# EAGLE design module S-RX28_rev3.3 644 (EAGLE 9.3.1)
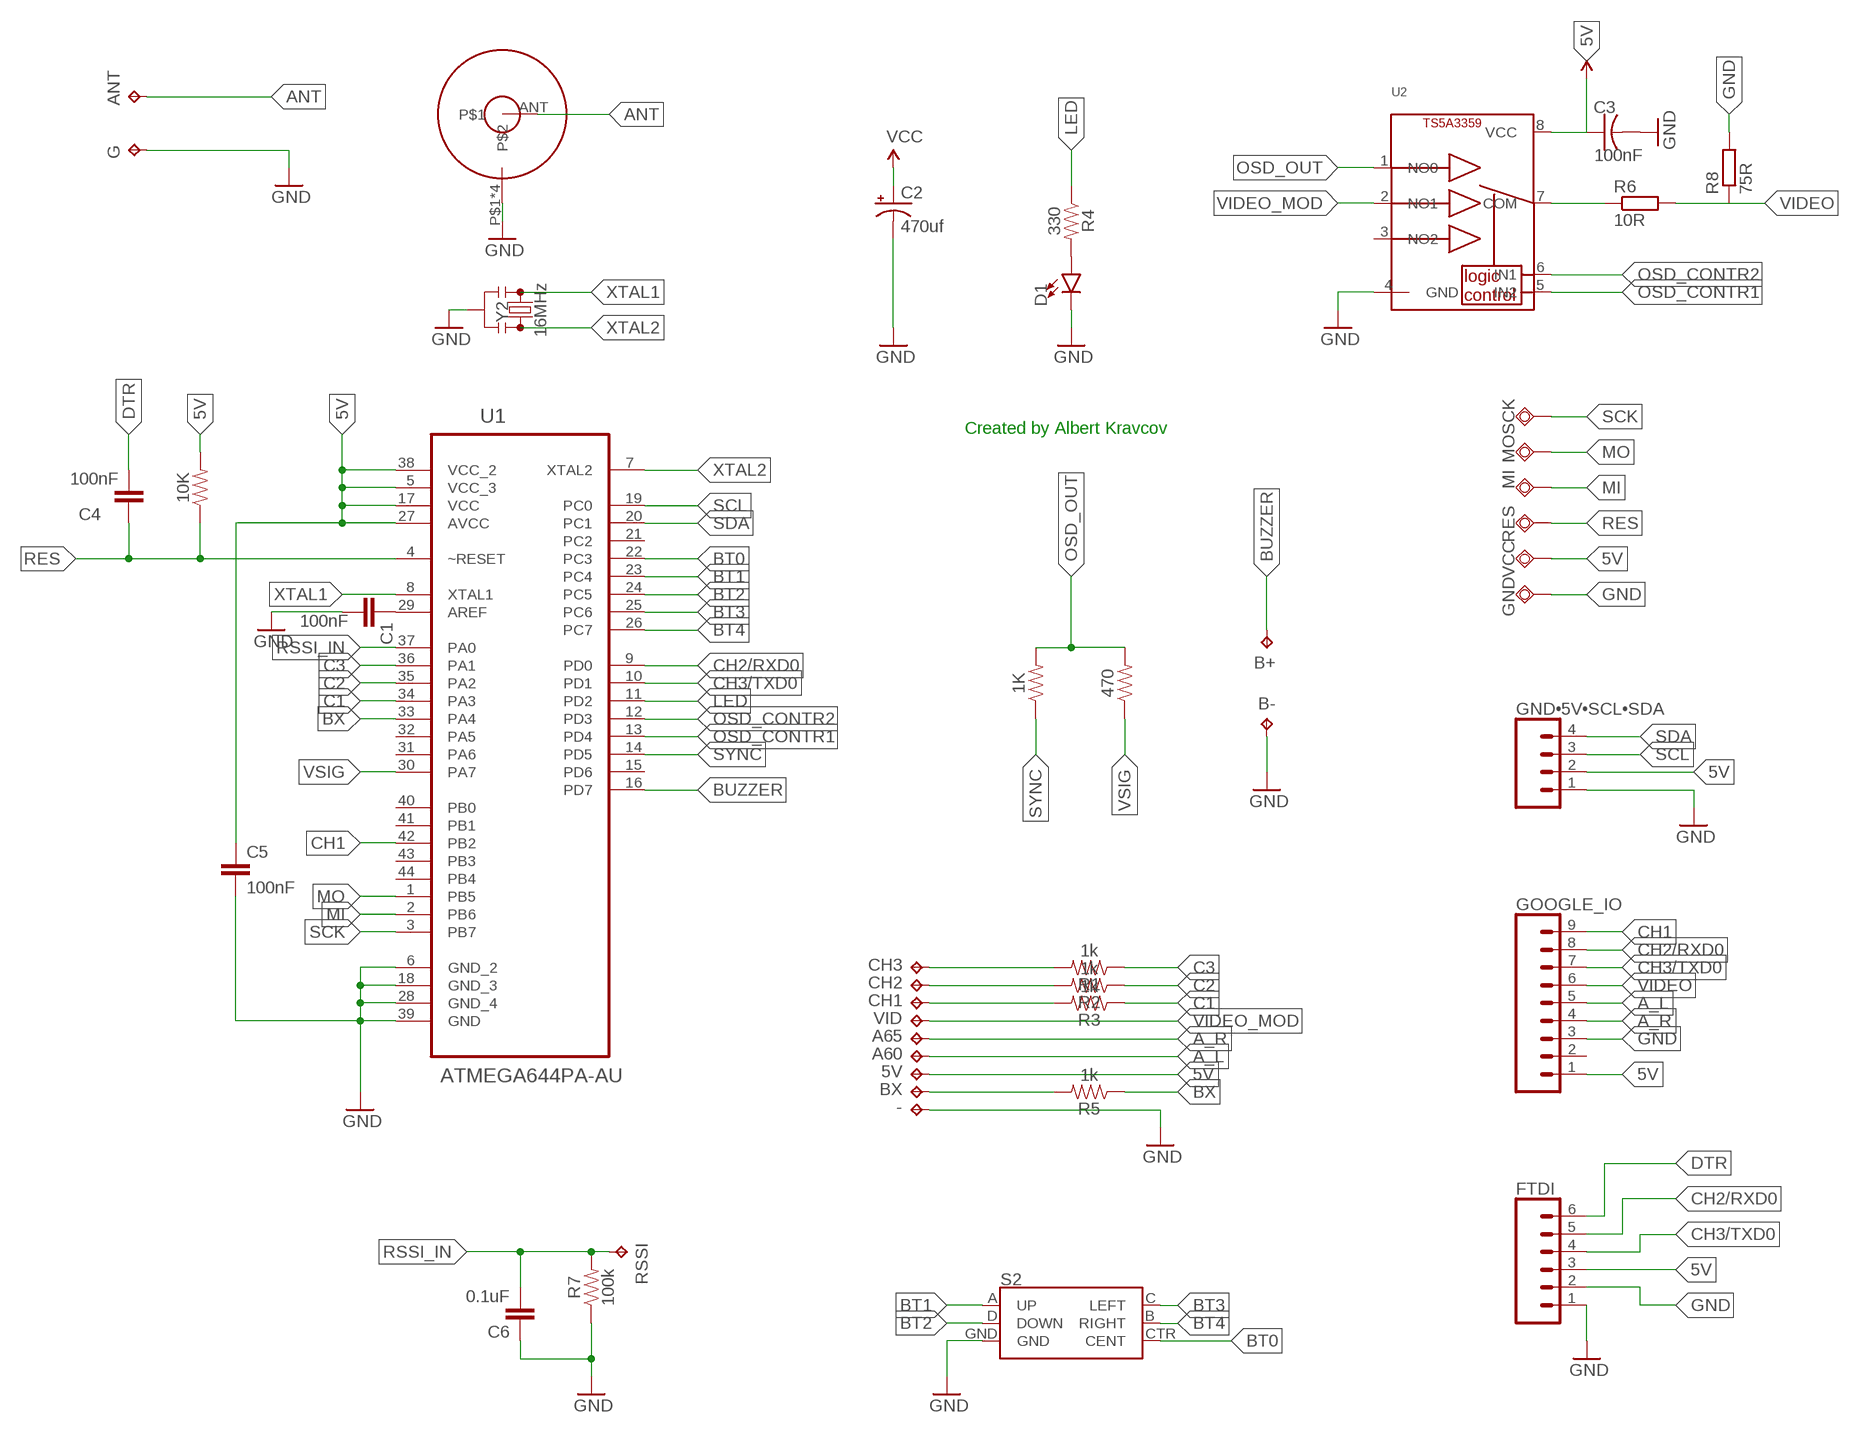
[diagram p0: schematic, sheet 1]

## Parts
1K  0.27OHM-0603-1/10W-1%  [0603]
5V  TPTP15SQ  [TP15SQ]
10K  0.27OHM-0603-1/10W-1%  [0603]
470  0.27OHM-0603-1/10W-1%  [0603]
-  TPTP15SQ  [TP15SQ]
A60  TPTP15SQ  [TP15SQ]
A65  TPTP15SQ  [TP15SQ]
ANT  TPTP15R  [TP15R]
B+  TPTP17SQ  [TP17SQ]
B-  TPTP17SQ  [TP17SQ]
BX  TPTP15SQ  [TP15SQ]
C1  100nF  10NF-0603-50V-10%  [0603]
C2  470uf  CAP_POL7343  [EIA7343]
C3  100nF  C-USC0603  [C0603]
C4  100nF  10NF-0603-50V-10%  [0603]
C5  100nF  10NF-0603-50V-10%  [0603]
C6  0.1uF  10NF-0603-50V-10%  [0603]
CH1  TPTP15SQ  [TP15SQ]
CH2  TPTP15SQ  [TP15SQ]
CH3  TPTP15SQ  [TP15SQ]
D1  LED0603  [LED-0603]
FTDI  CONN_06SMD-1MM  [1X06-1MM]
G  TPTP15SQ  [TP15SQ]
GND  GND  TPSQB1,27  [B1,27]
GND•5V•SCL•SDA  CONN_04  [1X04]
GOOGLE_IO  CONN_09  [1X09]
MI  TPSQB1,27  [B1,27]
MO  TPSQB1,27  [B1,27]
R1  1k  0.05OHM-0603-1/5W-1%  [0603]
R2  1k  0.05OHM-0603-1/5W-1%  [0603]
R3  1k  0.05OHM-0603-1/5W-1%  [0603]
R4  330  0.05OHM-0603-1/5W-1%  [0603]
R5  1k  0.05OHM-0603-1/5W-1%  [0603]
R6  10R  R-EU_R0603  [R0603]
R7  100k  0.05OHM-0603-1/5W-1%  [0603]
R8  75R  R-EU_R0603  [R0603]
RES  TPSQB1,27  [B1,27]
RSSI  TPTP15SQ  [TP15SQ]
S2  JOYSTICK_MINI  [JOYSTICK_MINI]
SCK  TPSQB1,27  [B1,27]
U1  ATMEGA644PA-AU  [QFP80P1200X1200X120-44N]
U2  TS5A3359  [VFSOP-8]
U$1  SMA_ANTENNA  [SMA_CONNECTOR]
VCC  TPSQB1,27  [B1,27]
VID  TPTP15SQ  [TP15SQ]
Y2  16MHz  RESONATOR-16MHZSMD_3.2X1.3  [RESONATOR-SMD-3.2X1.3]

## Nets
5V: 5V.TP 10K.2 C2.A(+) C3.1 C5.1 FTDI.3 GND•5V•SCL•SDA.2 GOOGLE_IO.1 U1.5(VCC_3) U1.17(VCC) U1.27(AVCC) U1.38(VCC_2) U2.8(VCC) VCC.TP ; supply symbol labelled VCC
A_L: A60.TP GOOGLE_IO.5
A_R: A65.TP GOOGLE_IO.4
ANT [power]: ANT.TP U$1.ANT
AREF: C1.1 U1.29(AREF)
BT0: S2.CTR(CENT) U1.22(PC3)
BT1: S2.A(UP) U1.23(PC4)
BT2: S2.D(DOWN) U1.24(PC5)
BT3: S2.C(LEFT) U1.25(PC6)
BT4: S2.B(RIGHT) U1.26(PC7)
BUZZER: B+.TP U1.16(PD7)
BX: R5.1 U1.33(PA4)
C1: R3.1 U1.34(PA3)
C2: R2.1 U1.35(PA2)
C3: R1.1 U1.36(PA1)
CH1: GOOGLE_IO.9 U1.42(PB2)
CH2/RXD0: FTDI.5 GOOGLE_IO.8 U1.9(PD0)
CH3/TXD0: FTDI.4 GOOGLE_IO.7 U1.10(PD1)
DTR: C4.2 FTDI.6
GND: -.TP B-.TP C1.2 C2.C(-) C3.2 C5.2 C6.1 D1.C FTDI.1 FTDI.2 G.TP GND.TP GND•5V•SCL•SDA.1 GOOGLE_IO.3 R7.1 R8.2 S2.GND U1.6(GND_2) U1.18(GND_3) U1.28(GND_4) U1.39(GND) U2.4(GND) U$1.P$1 U$1.P$2 U$1.P$3 U$1.P$4 Y2.2
LED: R4.1 U1.11(PD2)
MI: MI.TP U1.2(PB6)
MO: MO.TP U1.1(PB5)
N$1: CH3.TP R1.2
N$3: CH2.TP R2.2
N$4: CH1.TP R3.2
N$5: BX.TP R5.2
OSD_CONTR1: U1.13(PD4) U2.5(IN2)
OSD_CONTR2: U1.12(PD3) U2.6(IN1)
OSD_OUT: 1K.2 470.2 U2.1(NO0)
RED: D1.A R4.2
RES: 10K.1 C4.1 RES.TP U1.4(~RESET)
RSSI_IN: C6.2 R7.2 RSSI.TP U1.37(PA0)
SCK: SCK.TP U1.3(PB7)
SCL: GND•5V•SCL•SDA.3 U1.19(PC0)
SDA: GND•5V•SCL•SDA.4 U1.20(PC1)
SYNC: 1K.1 U1.14(PD5)
VIDEO [power]: GOOGLE_IO.6 R6.2 R8.1
VIDEO_MOD: U2.2(NO1) VID.TP
VIDEOOUTPUT: R6.1 U2.7(COM)
VSIG [power]: 470.1 U1.30(PA7)
XTAL1: U1.8(XTAL1) Y2.1
XTAL2: U1.7(XTAL2) Y2.3
Unconnected: GOOGLE_IO.2 U1.15(PD6) U1.21(PC2) U1.31(PA6) U1.32(PA5) U1.40(PB0) U1.41(PB1) U1.43(PB3) U1.44(PB4) U2.3(NO2)

## Notes on the sheet
- Created by Albert Kravcov

## Library data of the parts
1K 10K 470 = SparkFun-Resistors:0.27OHM: 0.27Ω resistor A resistor is a passive two-terminal electrical component that implements electrical resistance as a circuit element. Resistors act to reduce current flow, and, at the same time, act to lower voltage levels within circuits. - Wikipedia; PROD_ID: RES-08787; VALUE: 0.27
5V - A60 A65 ANT B+ B- BX CH1-CH3 G RSSI VID = testpad:TP: Test pad
C1 C4-C6 = SparkFun-Capacitors:10NF: 0.01uF/10nF/10,000pF ceramic capacitors A capacitor is a passive two-terminal electrical component used to store electrical energy temporarily in an electric field. CAP-09321; PROD_ID: CAP-00867; VALUE: 10nF
C2 = SparkFun-Passives:CAP_POL: Capacitor Polarized These are standard SMD and PTH capacitors. Normally 10uF, 47uF, and 100uF in electrolytic and tantalum varieties. Always verify the external diameter of the through hole cap, it varies with capacity, voltage, and manufacturer. The EIA devices should be standard.
C3 = adafruit:C-US: CAPACITOR, American symbol
D1 = SparkFun-LED:LED: LED (Generic) Standard schematic elements and footprints for 5mm, 3mm, 1206, and 0603 sized LEDs. Generic LEDs with no color specified.
FTDI = SparkFun-Connectors:CONN_06: Multi connection point. Often used as Generic Header-pin footprint for 0.1 inch spaced/style header connections On any of the 0.1 inch spaced packages, you can populate with these: Break Away Headers - Straight <https://www.sparkfun.com/products/116> (PRT-00116) Break Away Male Headers - Right Angle <https://www.sparkfun.com/products/553> (PRT-00553) Female Headers <https://www.sparkfun.com/products/115> (PRT-00115) Break Away Headers - Machine Pin <https://www.sparkfun.com/products/117> (PRT-00117) Break Away Female Headers - Swiss Machine Pin <https://www.sparkfun.com/products/743> (PRT-00743) Arduino Stackable Header - 6 Pin <https://www.sparkfun.com/products/9280> (PRT-09280) For SCREWTERMINALS and SPRING TERMINALS visit here: Screw Terimnals on SparkFun.com <https://www.sparkfun.com/search/results?term=Screw+Terminals> (5mm/3.5mm/2.54mm spacing) This device is also useful as a general connection point to wire up your design to another part of your project. Our various solder wires solder well into these plated through hole pads. Hook-Up Wire - Assortment (Stranded, 22 AWG) <https://www.sparkfun.com/products/11375> (PRT-11375) Hook-Up Wire - Assortment (Solid Core, 22 AWG) <https://www.sparkfun.com/products/11367> (PRT-11367) View the entire wire category on our website here <https://www.sparkfun.com/categories/141>; PROD_ID: CONN-08249; SF_ID: GPS-00579
GND MI MO RES SCK VCC = testpad:TPSQ: Test pad
GND•5V•SCL•SDA = SparkFun-Connectors:CONN_04: Multi connection point. Often used as Generic Header-pin footprint for 0.1 inch spaced/style header connections On any of the 0.1 inch spaced packages, you can populate with these: Break Away Headers - Straight <https://www.sparkfun.com/products/116> (PRT-00116) Break Away Male Headers - Right Angle <https://www.sparkfun.com/products/553> (PRT-00553) Female Headers <https://www.sparkfun.com/products/115> (PRT-00115) Break Away Headers - Machine Pin <https://www.sparkfun.com/products/117> (PRT-00117) Break Away Female Headers - Swiss Machine Pin <https://www.sparkfun.com/products/743> (PRT-00743) For SCREWTERMINALS and SPRING TERMINALS visit here: Screw Terimnals on SparkFun.com <https://www.sparkfun.com/search/results?term=Screw+Terminals> (5mm/3.5mm/2.54mm spacing) This device is also useful as a general connection point to wire up your design to another part of your project. Our various solder wires solder well into these plated through hole pads. Hook-Up Wire - Assortment (Stranded, 22 AWG) <https://www.sparkfun.com/products/11375> (PRT-11375) Hook-Up Wire - Assortment (Solid Core, 22 AWG) <https://www.sparkfun.com/products/11367> (PRT-11367) View the entire wire category on our website here <https://www.sparkfun.com/categories/141> Special notes: Molex polarized connector foot print use with SKU : PRT-08231 with associated crimp pins and housings. 1MM SMD Version SKU: PRT-10208; PROD_ID: CONN-09696
GOOGLE_IO = SparkFun-Connectors:CONN_09: Multi connection point. Often used as Generic Header-pin footprint for 0.1 inch spaced/style header connections On any of the 0.1 inch spaced packages, you can populate with these: Break Away Headers - Straight <https://www.sparkfun.com/products/116> (PRT-00116) Break Away Male Headers - Right Angle <https://www.sparkfun.com/products/553> (PRT-00553) Female Headers <https://www.sparkfun.com/products/115> (PRT-00115) Break Away Headers - Machine Pin <https://www.sparkfun.com/products/117> (PRT-00117) Break Away Female Headers - Swiss Machine Pin <https://www.sparkfun.com/products/743> (PRT-00743) For SCREWTERMINALS and SPRING TERMINALS visit here: Screw Terimnals on SparkFun.com <https://www.sparkfun.com/search/results?term=Screw+Terminals> (5mm/3.5mm/2.54mm spacing) This device is also useful as a general connection point to wire up your design to another part of your project. Our various solder wires solder well into these plated through hole pads. Hook-Up Wire - Assortment (Stranded, 22 AWG) <https://www.sparkfun.com/products/11375> (PRT-11375) Hook-Up Wire - Assortment (Solid Core, 22 AWG) <https://www.sparkfun.com/products/11367> (PRT-11367) View the entire wire category on our website here <https://www.sparkfun.com/categories/141> Special notes: Molex polarized connector foot print use with SKU : PRT-08231 with associated crimp pins and housings. 1MM SMD Version SKU: PRT-10208 NOTES ON THE VARIANTS LOCK and LOCK_LONGPADS... This footprint was designed to help hold the alignment of a through-hole component (i.e. 6-pin header) while soldering it into place. You may notice that each hole has been shifted either up or down by 0.005 of an inch from it's more standard position (which is a perfectly straight line). This slight alteration caused the pins (the squares in the middle) to touch the edges of the holes. Because they are alternating, it causes a "brace" to hold the component in place. 0.005 has proven to be the perfect amount of "off-center" position when using our standard breakaway headers. Although looks a little odd when you look at the bare footprint, once you have a header in there, the alteration is very hard to notice. Also,if you push a header all the way into place, it is covered up entirely on the bottom side.
R1-R5 R7 = SparkFun-Resistors:0.05OHM: 0.05Ω resistor A resistor is a passive two-terminal electrical component that implements electrical resistance as a circuit element. Resistors act to reduce current flow, and, at the same time, act to lower voltage levels within circuits. - Wikipedia; PROD_ID: RES-12535; VALUE: 0.05
R6 R8 = resistor:R-EU_: RESISTOR, European symbol
S2 = SparkFun-Switches:JOYSTICK_MINI: Small Tactile Joystick w/ Select Switch A 5-way tactile switch allows for a joystick-like interface in a very small package. Part #: 4UCON SF303GJ26 SparkFun Products 5-way Tactile Switch <https://www.sparkfun.com/products/10063> (COM-10063) Used on SparkFun Block for Intel® Edison - OLED <https://www.sparkfun.com/products/13035> (DEV-13035) Used on CAN-BUS Shield <https://www.sparkfun.com/products/13262> (DEV-13262); PROD_ID: SWCH-09905; SF_SKU: COM-10063
U1 = ATMEGA644PA-AU:ATMEGA644PA-AU: 8-bit Microcontroller Microcontroller In-System Programmable Flash; AVAILABILITY: Unavailable; DESCRIPTION: ATmega Series 20 MHz 64 KB Flash 4 KB SRAM 8-Bit Microcontroller - TQFP-44; MF: Microchip; MP: ATMEGA644PA-AU; PACKAGE: TQFP-44 Microchip; PRICE: None
U2 = ts5a3359:TS5A3359: 74AUP2G126 - Low-Power Dual Tri-State Buffer OE high enables output. For OE Low enabled output use 74AUP2G125. VCC: 0.8-3.6V Temp: -40°C - 125°C Package Variant: 8-VSSOP (SOT765-1) Manuf. ID: 74AUP2G126DC,125 Digikey: 568-4987-1-ND NOTE: Make sure to check the propogation delay to see if it's short enough for your timing since it's largely dependant on the line capacitance and supply voltage!
U$1 = #fpv:SMA_ANTENNA
Y2 = SparkFun-Clocks:RESONATOR-16MHZ: 16MHz Resonator Digikey Example <http://www.digikey.com/product-detail/en/murata-electronics-north-america/CSTCE16M0V53-R0/490-1198-1-ND/584635> Frequency: 16MHz Frequency Stability: ±0.3% Frequency Tolerance: ±0.5% Capacitance: 15pF SparkFun Products SparkFun OpenLog <https://www.sparkfun.com/products/13712> SparkFun MicroView - OLED Arduino Module <https://www.sparkfun.com/products/12923>; PROD_ID: XTAL-08900

## Net classes
0 default: width 0.2 mm, clearance 0.2 mm
1 power: width 0.3 mm, drill 0.3 mm, clearance 0.3 mm

## Board
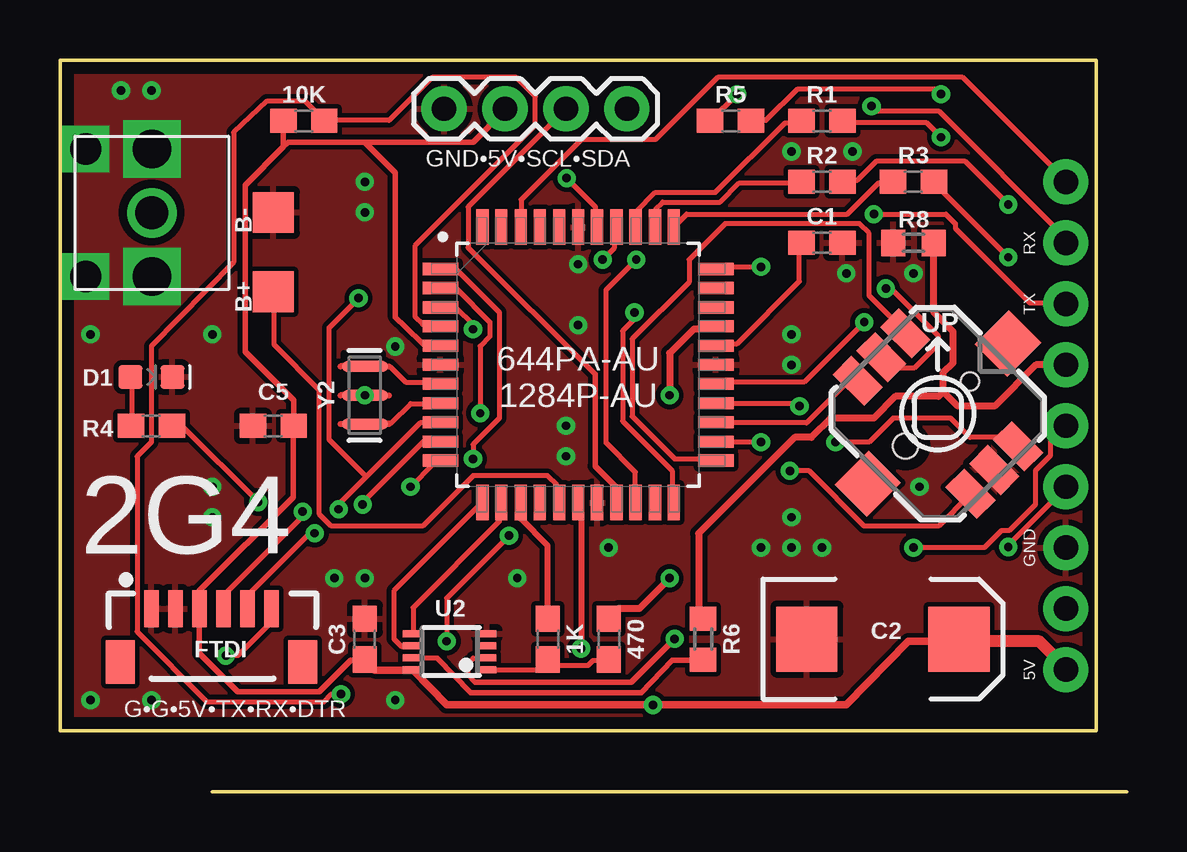
[diagram p1: board, top side]
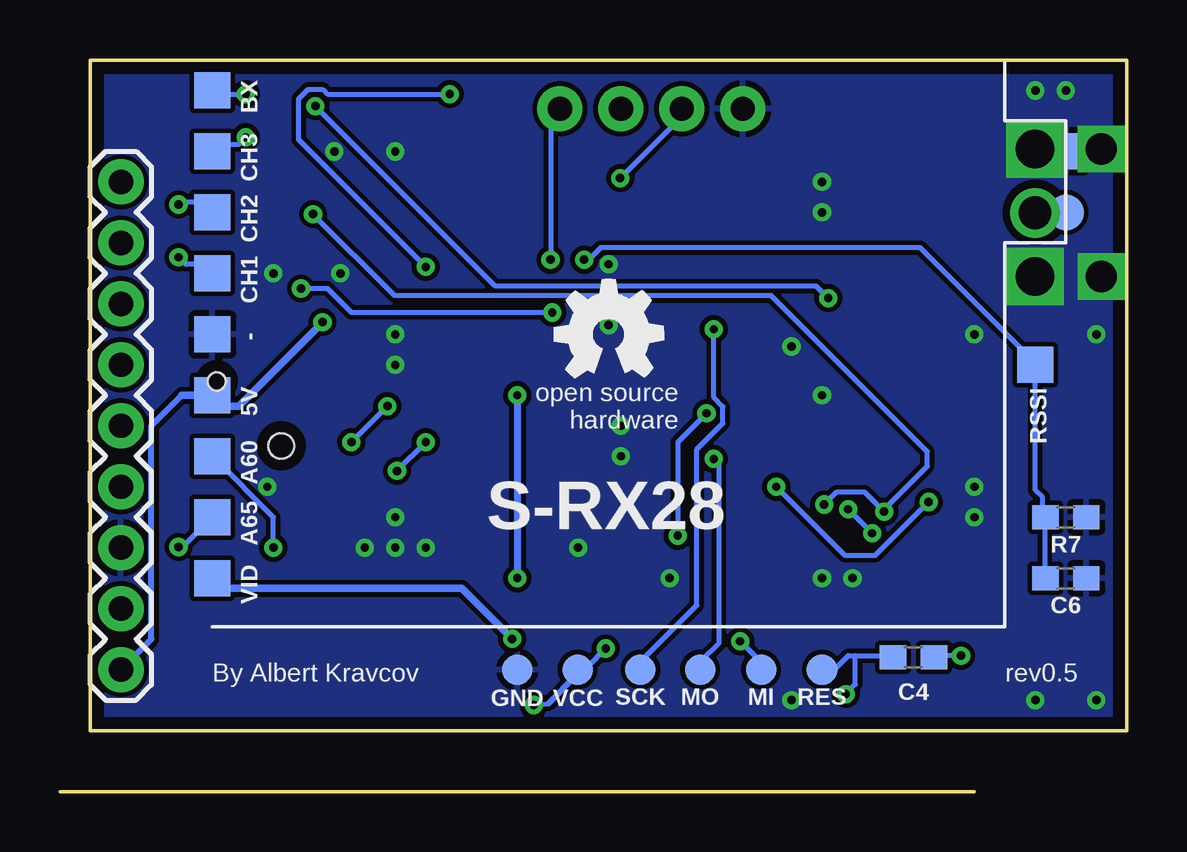
[diagram p2: board, bottom side, seen from below]

Size 44.45 x 30.48 mm. Coordinates in mm from the lower left corner, seen from the top.
Outline: 0,2.54 0,30.48 43.18,30.48 43.18,2.54 0,2.54
Copper layers (1*16): Top 0.035mm / dielectric 1.5mm / Bottom 0.035mm
Design rules "default *": minimum track width 6mil, minimum drill 0.35mm, track to track 6mil, track to pad 6mil, pad to pad 6mil, via to via 6mil, smd to smd 6mil, copper to edge 0.5mm, drill to drill 6mil, minimum pad ring 10mil, minimum via ring 8mil, stop-mask expansion 4mil, vias tented up to drill 2mm, thermal gap 10mil
tRestrict: area 11.8,14.7 to 13.5,18.3

### Footprints (pad centres in the part's own frame; a part is rotated, then mirrored left to right if it is on the bottom)
0603 = smd 1.1 x 1: 1 -0.85,0; 2 0.85,0
TP15SQ = smd 1.5 x 1.5: TP 0,0
TP15R = smd 1.5 x 1.5: TP 0,0
TP17SQ = smd 1.7 x 1.7: TP 0,0
EIA7343 = smd 2.55 x 2.7: A 3.17,0; C -3.17,0
C0603 = smd 1.1 x 1: 1 -0.85,0; 2 0.85,0
LED-0603 = smd 1 x 1: A -0.877,0; C 0.877,0
1X06-1MM = smd 0.6 x 1.55: 1 -2.54,1.27; 2 -1.54,1.27; 3 -0.54,1.27; 4 0.46,1.27; 5 1.46,1.27; 6 2.46,1.27 | smd 1.2 x 1.8: P$1 -3.84,-0.955; P$2 3.76,-0.955
B1,27 = smd 1.27 x 1.27: TP 0,0
1X04 = drill 1.016 pad 1.88: 1 0,0; 2 2.54,0; 3 5.08,0; 4 7.62,0
1X09 = drill 1.016 pad 1.88: 1 0,0; 2 2.54,0; 3 5.08,0; 4 7.62,0; 5 10.16,0; 6 12.7,0; 7 15.24,0; 8 17.78,0; 9 20.32,0
R0603 = smd 1 x 1.1: 1 -0.85,0; 2 0.85,0
JOYSTICK_MINI = smd 1.85 x 1.1: A -3.325,1.4; B 3.325,1.4; C -3.325,-1.4; CTR -3.325,0; D 3.325,-1.4; GND 3.325,0 | smd 1.9 x 2: NC 0,4.13; NC@0 0,-4.13 | hole 0.75: 0,1.9 | hole 1.05: 0,-1.9
QFP80P1200X1200X120-44N = smd 1.473 x 0.508: 1 -5.74,3.988; 2 -5.74,3.2; 3 -5.74,2.388; 4 -5.74,1.6; 5 -5.74,0.787; 6 -5.74,0; 7 -5.74,-0.787; 8 -5.74,-1.6; 9 -5.74,-2.388; 10 -5.74,-3.2; 11 -5.74,-3.988; 23 5.74,-3.988; 24 5.74,-3.2; 25 5.74,-2.388; 26 5.74,-1.6; 27 5.74,-0.787; 28 5.74,0; 29 5.74,0.787; 30 5.74,1.6; 31 5.74,2.388; 32 5.74,3.2; 33 5.74,3.988 | smd 0.508 x 1.473: 12 -3.988,-5.74; 13 -3.2,-5.74; 14 -2.388,-5.74; 15 -1.6,-5.74; 16 -0.787,-5.74; 17 0,-5.74; 18 0.787,-5.74; 19 1.6,-5.74; 20 2.388,-5.74; 21 3.2,-5.74; 22 3.988,-5.74; 34 3.988,5.74; 35 3.2,5.74; 36 2.388,5.74; 37 1.6,5.74; 38 0.787,5.74; 39 0,5.74; 40 -0.787,5.74; 41 -1.6,5.74; 42 -2.388,5.74; 43 -3.2,5.74; 44 -3.988,5.74
VFSOP-8 = smd 0.3 x 0.8: 1 0,0; 2 0.5,0; 3 1,0; 4 1.5,0; 5 1.5,3.1; 6 1,3.1; 7 0.5,3.1; 8 0,3.1
SMA_CONNECTOR = drill 1.37: ANT -0.02,-0.017 | drill 1.3 square: P$1 -2.67,2.743; P$2 2.64,2.743 | drill 1.6 square: P$3 -2.67,-0.017; P$4 2.64,-0.017
RESONATOR-SMD-3.2X1.3 = smd 0.45 x 1.905: 1 -1.2,0; 2 0,0; 3 1.2,0

### Placement (x,y rotation side)
1K  20.32,6.35 270 top
5V  38.1,16.51 0 bottom
10K  10.16,27.94 180 top
470  22.86,6.35 270 top
-  38.1,19.05 0 bottom
A60  38.1,13.97 0 bottom
A65  38.1,11.43 0 bottom
ANT  2.54,24.13 0 bottom
B+  8.89,20.83 0 top
B-  8.89,24.13 0 top
BX  38.1,29.21 0 bottom
C1  31.75,22.86 0 top
C2  34.29,6.35 0 top
C3  12.7,6.35 90 top
C4  8.89,5.59 0 bottom
C5  8.89,15.24 180 top
C6  2.54,8.89 180 bottom
CH1  38.1,21.59 0 bottom
CH2  38.1,24.13 0 bottom
CH3  38.1,26.67 0 bottom
D1  3.81,17.27 0 top
FTDI  6.35,6.35 0 top
G  2.54,26.67 0 bottom
GND  25.4,5.08 0 bottom
GND•5V•SCL•SDA  16,28.45 0 top
GOOGLE_IO  41.91,5.08 90 bottom
MI  15.24,5.08 0 bottom
MO  17.78,5.08 0 bottom
R1  31.75,27.94 0 top
R2  31.75,25.4 0 top
R3  35.56,25.4 0 top
R4  3.81,15.24 180 top
R5  27.94,27.94 0 top
R6  26.8,6.35 90 top
R7  2.54,11.43 180 bottom
R8  35.56,22.86 180 top
RES  12.7,5.08 0 bottom
RSSI  3.81,17.78 0 bottom
S2  36.58,15.75 315 top
SCK  20.27,5.08 0 bottom
U1  21.59,17.78 0 top
U2  17.78,5.08 90 top
U$1  3.81,24.13 90 top
U$2  [OSHW_5MM]  21.59,19.05 0 bottom
VCC  22.89,5.08 0 bottom
VID  38.1,8.89 0 bottom
Y2  12.7,16.51 90 top

### Tracks (layer width: path | path; a pad name or v marks a point on that pad's centre or on a via)
5V  (via drill 0.35)
  Top 0.2: v33.51,19.56 31.01,17.06 27.41,17.06 U1.27 | 37.48,6.26 C2.A 37.38,6.26 | 41.91,5.16 GOOGLE_IO.1 | 18.51,28.36 GND•5V•SCL•SDA.2 | 15.11,18.66 15.81,18.66 U1.5 | v21.11,25.56 22.31,24.36 22.31,23.56 U1.38 | 21.71,11.86 21.61,11.96 U1.17 | 13.11,5.06 12.71,5.46 C3.1 12.61,5.46 | 14.61,5.06 U2.8 14.71,5.06 | FTDI.3 5.81,8.36 | 9.71,14.96 C5.1
  Top 0.229: 9.31,26.86 9.51,27.06 12.7,27.06 | 10K.2 9.31,26.86 | 12.7,27.06 17.21,27.06 18.51,28.36 | 15.11,18.66 14.38,19.36 13.97,19.77 13.97,25.79 12.7,27.06 | 9.71,14.96 9.71,12.26 5.81,8.36 | 12.61,5.46 12.11,5.46 10.81,4.16 7.41,4.16 5.81,5.76 FTDI.3 | 9.31,26.86 7.71,25.26 7.71,18.33 9.74,16.3 C5.1
  Top 0.254: 21.71,11.86 v21.71,5.96
  Top 0.305: 13.11,5.06 14.61,5.06 | 14.71,5.06 16.11,3.61 v24.71,3.61 32.75,3.61 35.35,6.26 37.38,6.26
  Top 0.508: 37.48,6.26 40.81,6.26 41.91,5.16
  Bottom 0.2: 38.32,16.12 38.72,16.51 | 38.11,16.06 38.11,16.12 38.1,16.13 5V.TP | v21.11,25.56 18.61,28.06 18.61,28.36 GND•5V•SCL•SDA.2 | 22.51,5.16 22.81,5.16 VCC.TP 22.91,5.06 22.91,4.86 | v24.71,3.61 24.11,3.66
  Bottom 0.229: v21.71,5.96 22.51,5.16 | 24.11,3.66 22.91,4.86
  Bottom 0.254: GOOGLE_IO.1 40.64,6.35 40.64,15.24 39.37,16.51
  Bottom 0.3: 5V.TP 38.32,16.29 38.32,16.12
  Bottom 0.305: 39.37,16.51 38.72,16.51 | v33.51,19.56 37.01,16.06 38.11,16.06
A_L  (via drill 0.35)
  Top 0.203: v35.56,10.16 38.52,10.16 39.23,10.87 39.55,10.87 40.64,11.96 40.64,13.38 41.26,14 41.26,14.59 GOOGLE_IO.5
  Bottom 0.2: 38.01,14.06 A60.TP
  Bottom 0.203: v35.56,10.16 35.56,11.43 38.01,13.88
  Bottom 0.3: 38.01,13.88 38.01,14.06
A_R  (via drill 0.35)
  Top 0.2: v39.51,10.19 39.48,10.23 41.91,12.66 GOOGLE_IO.4
  Bottom 0.2: v39.51,10.19 39.34,10.19 A65.TP
ANT
  Bottom 0.3: ANT.TP 2.56,24.11
  Bottom 0.762: 2.56,24.11 U$1.ANT
AREF
  Top 0.2: C1.1 30.81,22.86 30.81,21.26 28.21,18.66 27.41,18.66 U1.29
BT0  (via drill 0.35)
  Top 0.2: v23.94,19.96 23.94,19.69 23.44,19.19 23.44,15.43 25.51,13.36 25.51,12.06 U1.22 | v34.41,20.96 34.61,20.96 36.61,18.96 36.61,18.66 35.61,17.66 34.71,17.66 34.31,18.06 S2.CTR
  Bottom 0.2: v23.94,19.96 32.31,19.96 33.31,20.96 v34.41,20.96
BT1
  Top 0.2: U1.23 27.31,13.86 25.61,13.86 23.84,15.63 23.84,18.86 26.21,21.23 26.21,22.16 27.71,23.66 33.31,23.66 33.71,23.26 33.71,20.66 35.21,19.16 S2.A
BT2  (via drill 0.35)
  Top 0.2: v29.21,14.56 27.41,14.56 U1.24 | v30.41,13.36 31.21,13.36 33.51,11.06 36.61,11.06 37.91,12.36 S2.D
  Bottom 0.2: v30.41,13.36 v29.21,14.56
BT3
  Top 0.2: U1.25 27.41,15.36 31.11,15.36 32.81,17.06 33.21,17.06 S2.C
BT4  (via drill 0.35)
  Top 0.2: v30.81,16.06 30.71,16.16 27.41,16.16 U1.26 | v32.31,14.56 33.71,14.56 34.71,15.56 37.11,15.56 37.91,14.76 39.61,14.76 39.91,14.46 S2.B
  Bottom 0.2: v32.31,14.56 v30.81,16.06
BUZZER
  Top 0.2: 8.91,18.63 10.81,16.73 10.81,11.56 11.31,11.06 15.11,11.06 17.21,13.16 20.31,13.16 20.71,12.76 20.71,12.06 U1.16 | 8.91,19.53 8.91,20.76 B+.TP
  Top 0.203: 8.91,19.53 8.91,18.63
BX  (via drill 0.35)
  Top 0.2: v28.21,29.06 R5.1 | v29.21,21.86 27.41,21.86 U1.33
  Bottom 0.2: v28.21,29.06 33.31,29.06 33.51,29.26 34.11,29.26 34.51,28.86 34.51,27.16 v29.21,21.86
C1
  Top 0.2: R3.1 34.71,25.36 34.11,25.36 32.81,24.06 26.11,24.06 25.61,23.56 U1.34
C2
  Top 0.2: R2.1 30.81,25.36 28.31,25.36 27.51,24.56 25.11,24.56 24.81,24.26 24.81,23.56 U1.35
C3
  Top 0.2: R1.1 30.81,27.86 30.21,27.86 27.31,24.96 24.81,24.96 24.01,24.16 24.01,23.56 U1.36
CH1
  Top 0.2: U1.42 19.21,23.56 19.21,24.66 21.71,27.16 24.81,27.16 27.41,29.76 37.61,29.76 41.91,25.46 GOOGLE_IO.9
CH2/RXD0  (via drill 0.35)
  Top 0.2: 12.76,13.11 11.61,11.96 v11.61,11.76 | 12.76,13.11 15.01,15.36 15.81,15.36 U1.9 | v10.61,10.76 10.41,10.76 7.81,8.16 FTDI.5 | GOOGLE_IO.8 41.91,23.06 36.61,28.36 34.01,28.36 v33.81,28.56 | v12.44,20.56 11.21,19.33 11.21,14.66 12.76,13.11
  Bottom 0.2: v10.61,10.76 v11.61,11.76 | v33.81,28.56 26.31,21.06 12.94,21.06 v12.44,20.56
CH3/TXD0  (via drill 0.35)
  Top 0.2: v12.61,11.96 12.61,12.06 15.11,14.56 15.81,14.56 15.83,14.58 U1.10 | v10.11,11.66 10.11,11.46 6.81,8.16 FTDI.4 | v33.91,24.06 36.91,24.06 37.31,23.66 37.31,23.46 40.41,20.36 41.91,20.36 GOOGLE_IO.7
  Bottom 0.2: v12.61,11.96 12.11,12.46 10.91,12.46 v10.11,11.66 10.11,11.76 8.31,13.56 8.31,14.16 14.81,20.66 30.51,20.66 v33.91,24.06
DTR  (via drill 0.35)
  Top 0.2: v6.91,5.66 7.41,5.66 8.81,7.06 FTDI.6
  Bottom 0.2: v6.91,5.66 8.01,5.66 C4.2
GND  (via drill 0.35)
  other vias: 1.27,19.05 6.35,19.05 12.7,25.4 12.7,24.13 2.54,29.21 3.81,29.21 6.35,12.7 6.35,11.43 21.08,15.24 21.08,13.97 21.59,19.43 21.59,21.97 30.48,19.05 30.48,17.78 30.48,26.67 33.02,26.67 32.77,21.59 29.21,10.16 22.86,10.16 30.48,10.16 12.7,8.89 11.43,8.89 13.97,3.81 3.81,3.81 1.27,3.81 12.7,16.51 13.97,18.54 19.05,8.89 35.81,12.7 35.56,21.59 31.75,10.16 30.48,11.43
  pour Top: -7.62,33.02 50.8,33.02 50.8,-2.54 -7.62,-2.54
  pour Bottom: -8.89,-2.54 -8.89,40.64 48.26,40.64 48.26,-2.54
LED  (via drill 0.35)
  Top 0.2: 5.04,15.16 4.71,15.16 R4.1 5.08,15.24 v8.26,12.07 | v14.61,12.7 15.56,13.65 U1.11
  Bottom 0.2: v8.26,12.07 10.48,9.84 11.75,9.84 v14.61,12.7
MI  (via drill 0.35)
  Top 0.2: v16.11,6.26 16.11,8.06 v18.71,10.66 | v17.51,15.76 17.51,18.56 17.91,18.96 17.91,19.56 16.51,20.96 15.91,20.96 U1.2
  Bottom 0.2: v16.11,6.26 15.31,5.46 15.31,5.16 MI.TP | v18.71,10.66 18.71,14.56 v17.51,15.76
MO  (via drill 0.35)
  Top 0.2: v17.21,13.86 17.21,14.46 18.31,15.56 18.31,19.96 16.51,21.76 15.91,21.76 U1.1
  Bottom 0.2: v17.21,13.86 17.01,13.66 17.01,6.16 17.71,5.46 17.71,5.16 MO.TP
N$1  (via drill 0.35)
  Top 0.2: v36.71,27.26 36.11,27.86 32.61,27.86 R1.2
  Bottom 0.2: v36.71,27.26 37.01,26.96 37.81,26.96 CH3.TP
N$3  (via drill 0.35)
  Top 0.2: v39.51,24.46 37.71,26.26 34.01,26.26 33.21,25.46 32.61,25.46 R2.2
  Bottom 0.2: v39.51,24.46 39.41,24.56 38.51,24.56 38.11,24.16 CH2.TP
N$4  (via drill 0.35)
  Top 0.2: v39.51,22.26 36.41,25.36 R3.2
  Bottom 0.2: v39.51,22.26 39.21,21.96 38.41,21.96 38.11,21.66 CH1.TP
N$5  (via drill 0.35)
  Top 0.2: v36.71,29.06 36.51,29.26 30.71,29.26 29.41,27.96 28.81,27.96 R5.2
  Bottom 0.2: v36.71,29.06 37.91,29.06 38.01,29.16 BX.TP
OSD_CONTR1
  Top 0.2: U2.5 14.71,6.66 14.71,7.66 18.31,11.26 18.31,11.96 U1.13
OSD_CONTR2
  Top 0.2: U2.6 14.61,6.06 14.21,6.06 13.91,6.36 13.91,8.36 17.51,11.96 U1.12
OSD_OUT
  Top 0.2: U2.1 17.81,5.06 19.91,5.06 20.31,5.46 1K.2 20.41,5.46 20.61,5.26 22.01,5.26 22.21,5.46 22.81,5.46 470.2
RED
  Top 0.2: D1.A 3.01,17.26 3.01,15.26 R4.2
RES  (via drill 0.35)
  Top 0.2: 11.01,27.96 13.71,27.96 15.51,29.76 19.01,29.76 19.81,28.96 19.81,27.76 14.81,22.76 14.81,19.76 15.11,19.46 15.81,19.46 U1.4 | v11.71,4.06 11.31,4.06 11.01,3.73 6.11,3.73 3.21,6.66 3.21,13.96 3.81,14.56 3.81,18.56 7.24,22.06 7.24,27.46 8.61,28.76 10.21,28.76 11.01,27.96 | 11.01,27.96 10K.1
  Bottom 0.2: 11.31,5.66 11.61,5.66 12.11,5.16 12.61,5.16 RES.TP | 11.31,5.66 9.81,5.66 C4.1 | 11.31,5.66 11.31,4.46 v11.71,4.06
RSSI_IN  (via drill 0.35)
  Top 0.2: v22.61,22.16 23.11,22.66 23.11,23.46 U1.37
  Bottom 0.2: C6.2 3.41,8.96 3.41,11.36 R7.2 3.51,11.36 3.51,12.26 3.81,12.56 RSSI.TP 3.81,17.86 8.61,22.66 21.91,22.66 22.41,22.16 v22.61,22.16
SCK  (via drill 0.35)
  Top 0.2: v17.21,19.26 17.21,19.46 16.51,20.16 15.91,20.16 U1.3
  Bottom 0.2: SCK.TP 20.21,5.16 20.21,5.46 17.91,7.76 17.91,14.26 16.83,15.34 16.83,16.04 17.21,16.42 v17.21,19.26
SCL
  Top 0.2: 22.29,17.38 17.01,22.66 17.01,24.36 21.01,28.36 GND•5V•SCL•SDA.3
  Top 0.229: U1.19 23.19,12.66 22.29,13.56 22.29,17.38
SDA  (via drill 0.35)
  Top 0.2: v24.01,22.16 22.74,20.89 | 22.74,20.89 22.74,14.55 23.98,13.31 U1.20
  Top 0.203: 22.74,20.89
  Bottom 0.2: v24.01,22.16 24.01,28.03 24.21,28.23 23.99,28.45 GND•5V•SCL•SDA.4
SYNC
  Top 0.2: 19.21,11.36 19.21,11.96 U1.14 | 20.31,7.26 1K.1
  Top 0.254: 20.31,7.26 20.31,10.26 19.21,11.36
VIDEO
  Top 0.3: R8.1 36.41,19.96 37.21,19.16 37.21,17.86 36.81,17.46 36.81,16.66 | 36.81,16.66 37.41,16.06 38.94,16.06 40.66,17.78 GOOGLE_IO.6 | R6.2 26.61,7.46 26.61,10.76 30.61,14.76 31.31,14.76 32.11,15.56 33.91,15.56 34.81,16.46 36.61,16.46 36.81,16.66
VIDEO_MOD  (via drill 0.35)
  Top 0.2: 17.21,5.56 17.71,5.56 U2.2
  Top 0.203: 17.21,5.56 17.01,5.36 17.01,4.86
  Top 0.216: 17.31,4.56 17.01,4.86
  Top 0.229: 23.81,4.56 17.31,4.56
  Top 0.254: v25.61,6.36 23.81,4.56
  Bottom 0.2: 37.61,8.46 38.01,8.86 VID.TP
  Bottom 0.305: v25.61,6.36 27.71,8.46 37.61,8.46
VIDEOOUTPUT
  Top 0.2: 15.71,5.56 14.71,5.56 U2.7 | 26.71,5.46 R6.1
  Top 0.229: 15.71,5.56 17.11,4.12 24.21,4.12 25.51,5.46 26.71,5.46
VSIG  (via drill 0.35)
  Top 0.3: U1.30 27.22,19.27 26.41,19.27 25.4,18.26 v25.4,16.51 | 470.1 23.28,7.62 24.13,7.62 v25.4,8.89
  Bottom 0.3: v25.4,16.51 v25.4,8.89
XTAL1
  Top 0.2: U1.8 15.81,16.16 14.61,16.16 13.81,15.36 Y2.1
XTAL2
  Top 0.2: U1.7 15.81,17.06 14.41,17.06 13.81,17.66 Y2.3

### Text on the board
tPlace: RX | TX | GND | 5V | G•G•5V•TX•RX•DTR
bPlace: rev0.5 | By Albert Kravcov
tNames: • | 644PA-AU / 1284P-AU | 2G4
bNames: S-RX28